# EAGLE design h_bridge_v2.1 (EAGLE 5.11)
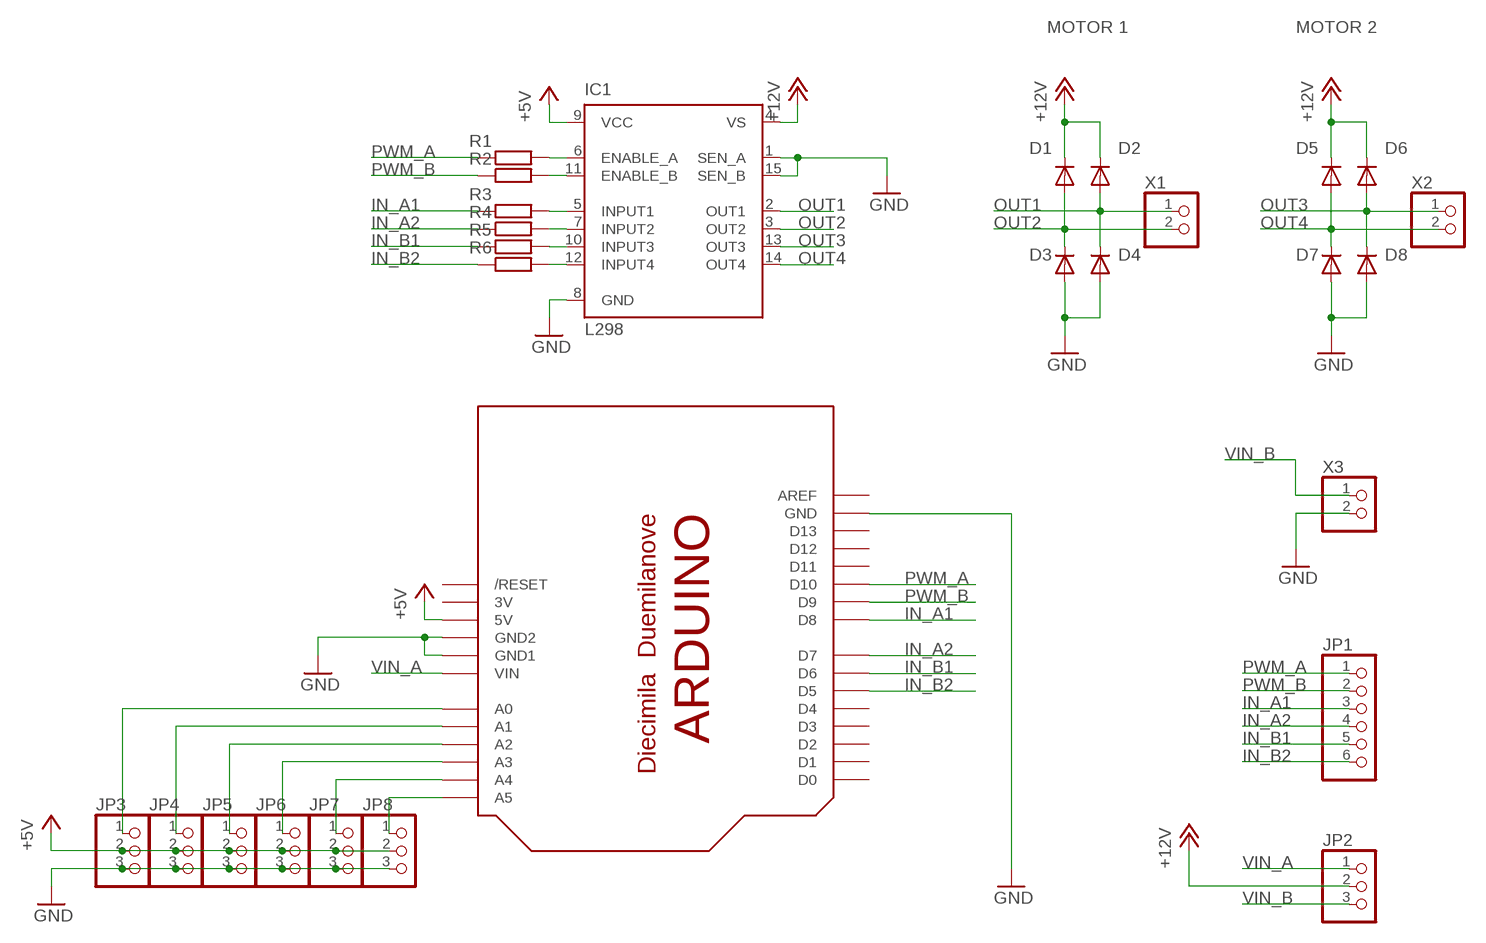
[diagram p0: schematic, sheet 1]

## Parts
D1  1N4004A  [DO41-10]
D2  1N4004A  [DO41-10]
D3  1N4004A  [DO41-10]
D4  1N4004A  [DO41-10]
D5  1N4004A  [DO41-10]
D6  1N4004A  [DO41-10]
D7  1N4004A  [DO41-10]
D8  1N4004A  [DO41-10]
IC1  L298  [MULTIWATT-15]
JP1  PINHD-1X6  [1X06]
JP2  PINHD-1X3180  [1X03]
JP3  PINHD-1X3180  [1X03]
JP4  PINHD-1X3180  [1X03]
JP5  PINHD-1X3180  [1X03]
JP6  PINHD-1X3180  [1X03]
JP7  PINHD-1X3180  [1X03]
JP8  PINHD-1X3180  [1X03]
R1  R-EU_0207/10  [0207/10]
R2  R-EU_0207/10  [0207/10]
R3  R-EU_0207/10  [0207/10]
R4  R-EU_0207/10  [0207/10]
R5  R-EU_0207/10  [0207/10]
R6  R-EU_0207/10  [0207/10]
U$1  ARDUINO-NOHOLE  [ARDUINO-NOHOLE]
X1  W237-102  [W237-102]
X2  W237-102  [W237-102]
X3  W237-102  [W237-102]

## Nets
+5V: IC1.9(VCC) JP3.2 JP4.2 JP5.2 JP6.2 JP7.2 JP8.2 U$1.5V
+12V: D1.C D2.C D5.C D6.C IC1.4(VS) JP2.2
GND: D3.A D4.A D7.A D8.A IC1.1(SEN_A) IC1.8(GND) IC1.15(SEN_B) JP3.3 JP4.3 JP5.3 JP6.3 JP7.3 JP8.3 U$1.GND U$1.GND1 U$1.GND2 X3.2
IN_A1: JP1.3 R3.1 U$1.D8
IN_A2: JP1.4 R4.1 U$1.D7
IN_B1: JP1.5 R5.1 U$1.D6
IN_B2: JP1.6 R6.1 U$1.D5
N$1: IC1.6(ENABLE_A) R1.2
N$2: IC1.11(ENABLE_B) R2.2
N$3: IC1.5(INPUT1) R3.2
N$4: IC1.7(INPUT2) R4.2
N$5: IC1.10(INPUT3) R5.2
N$6: IC1.12(INPUT4) R6.2
N$16: JP3.1 U$1.A0
N$17: JP4.1 U$1.A1
N$18: JP5.1 U$1.A2
N$19: JP6.1 U$1.A3
N$20: JP7.1 U$1.A4
N$21: JP8.1 U$1.A5
OUT1: D2.A D4.C IC1.2(OUT1) X1.1
OUT2: D1.A D3.C IC1.3(OUT2) X1.2
OUT3: D6.A D8.C IC1.13(OUT3) X2.1
OUT4: D5.A D7.C IC1.14(OUT4) X2.2
PWM_A: JP1.1 R1.1 U$1.D10
PWM_B: JP1.2 R2.1 U$1.D9
VIN_A: JP2.1 U$1.VIN
VIN_B: JP2.3 X3.1
Unconnected: U$1.AREF U$1.D0 U$1.D1 U$1.D2 U$1.D3 U$1.D4 U$1.D11 U$1.D12 U$1.D13 U$1.RESET(/RESET)

## Notes on the sheet
- MOTOR 1 | MOTOR 2

## Power pins joined to a net without a drawn wire
3V: U$1.3V

## Library data of the parts
D1-D8 = h_bridge_v2:1N4004: DIODE general purpose rectifier, 1 A
IC1 = h_bridge_v2:L298: DUAL FULL-BRIDGE DRIVER; MPN: L298N; OC_FARNELL: 1589425; OC_NEWARK: 32M1527
JP1 = h_bridge_v2:PINHD-1X6: PIN HEADER
JP2-JP8 = h_bridge_v2:PINHD-1X3: PIN HEADER
R1-R6 = h_bridge_v2:R-EU_: RESISTOR, European symbol
U$1 = h_bridge_v2:ARDUINO: Arduino Diecimila/Duemilanove Make a shield with ease, this package has all the named pins as well as the two mounting drill holes and an outline of the USB and DC power connector. The outline is on the DIMENSION layer, so if your board house uses it they will cut the outline to match. http://www.ladyada.net/library/pcb/eaglelibrary.html
X1-X3 = h_bridge_v2:W237-102: WAGO SCREW CLAMP

## Board
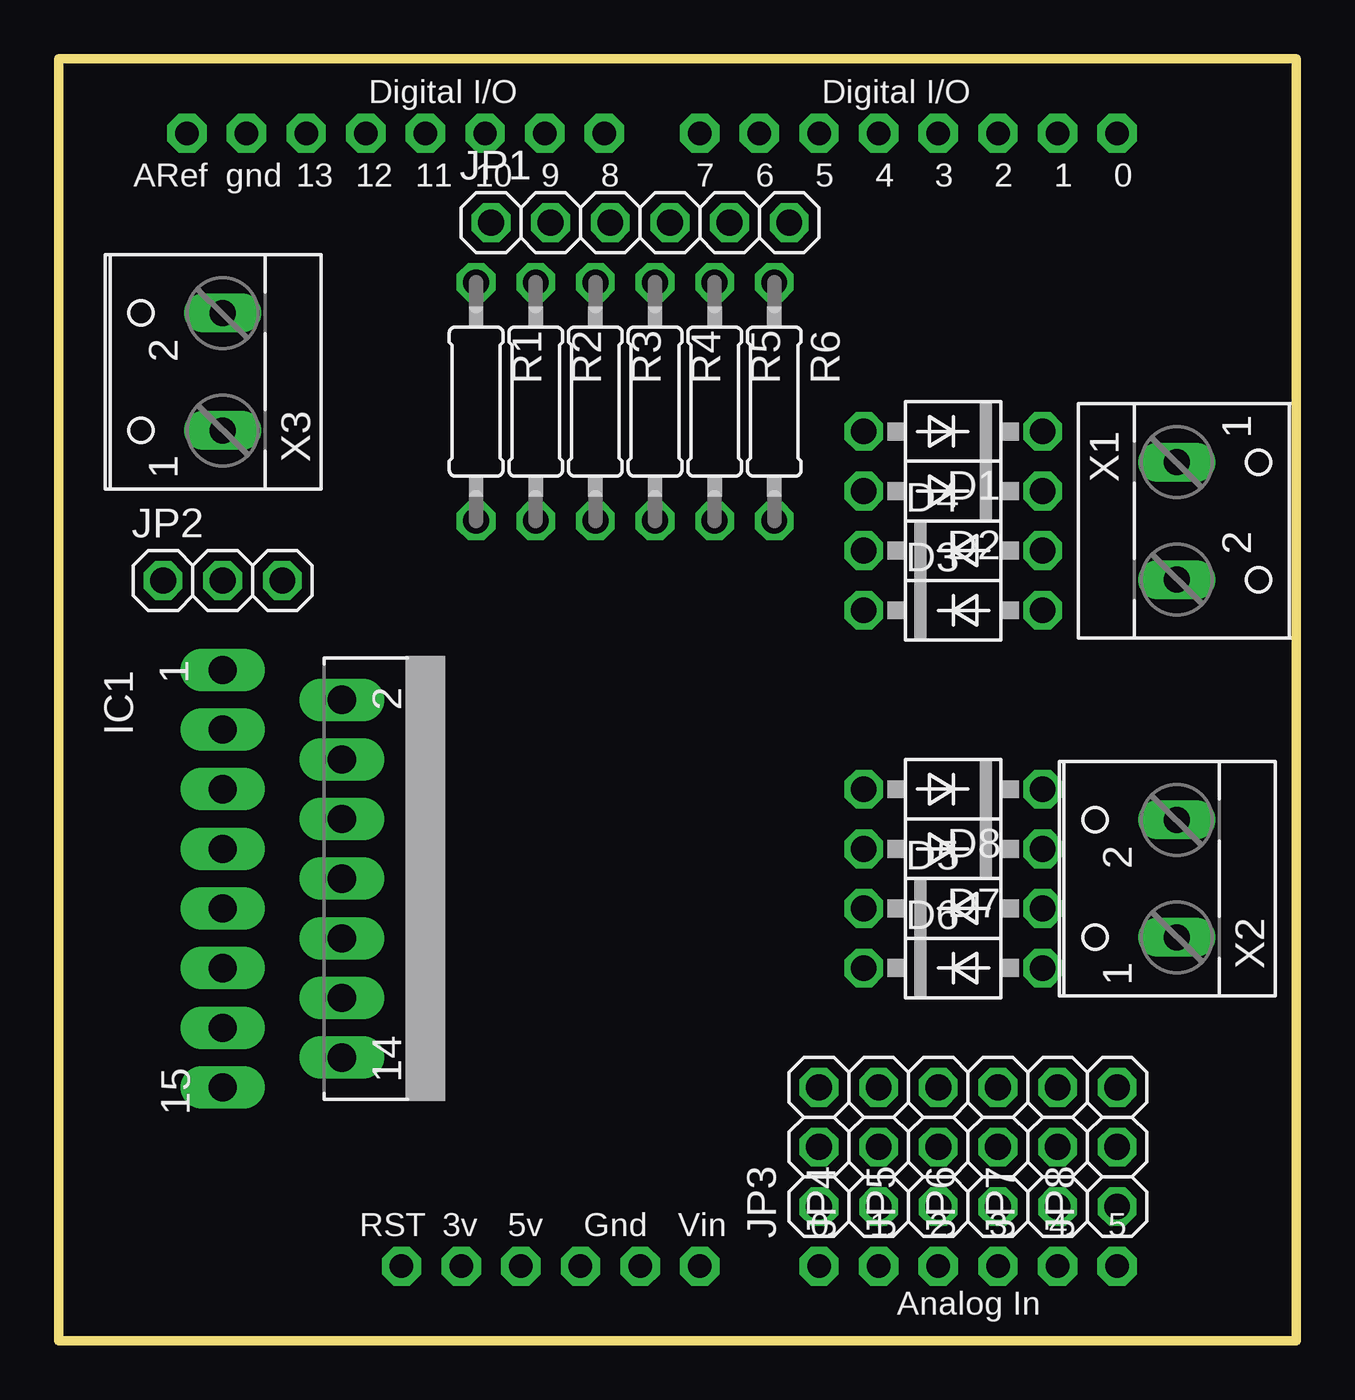
[diagram p1: board, top side]
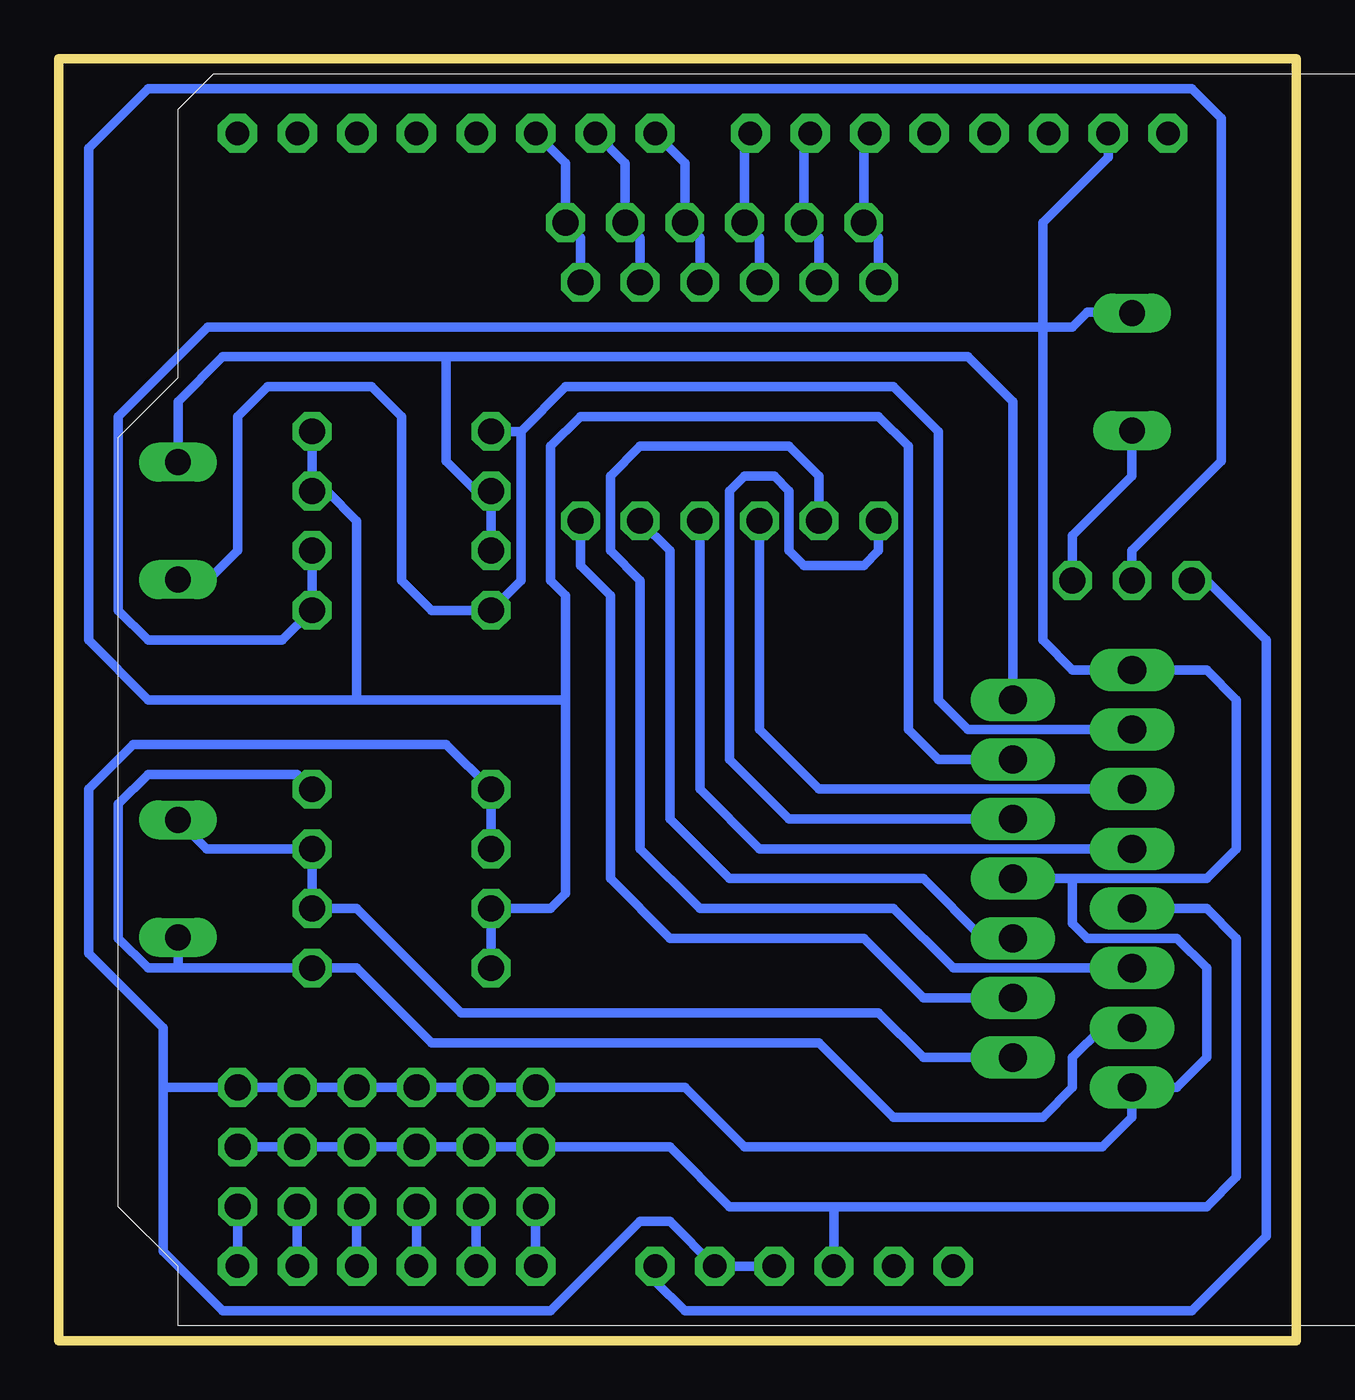
[diagram p2: board, bottom side, seen from below]

Size 52.7 x 54.61 mm. Coordinates in mm from the lower left corner, seen from the top.
Outline: 0,0 52.7,0 52.7,54.61 0,54.61 0,0
Copper layers (1*16): Top 0.035mm / dielectric 1.5mm / Bottom 0.035mm
Design rules "default": minimum track width 10mil, minimum drill 24mil, track to track 8mil, track to pad 8mil, pad to pad 8mil, via to via 8mil, smd to smd 8mil, copper to edge 40mil, drill to drill 8mil, minimum pad ring 10mil, minimum via ring 8mil, stop-mask expansion 4mil, vias tented up to drill 0mil, thermal gap 10mil

### Footprints (pad centres in the part's own frame; a part is rotated, then mirrored left to right if it is on the bottom)
DO41-10 = drill 1.1 octagon: A 3.81,0; C -3.81,0
MULTIWATT-15 = drill 1.2 long: 1 -8.89,-7.62; 2 -7.62,-2.54; 3 -6.35,-7.62; 4 -5.08,-2.54; 5 -3.81,-7.62; 6 -2.54,-2.54; 7 -1.27,-7.62; 8 0,-2.54; 9 1.27,-7.62; 10 2.54,-2.54; 11 3.81,-7.62; 12 5.08,-2.54; 13 6.35,-7.62; 14 7.62,-2.54; 15 8.89,-7.62
1X06 = drill 1.1 octagon: 1 -6.35,0; 2 -3.81,0; 3 -1.27,0; 4 1.27,0; 5 3.81,0; 6 6.35,0
1X03 = drill 1.1 octagon: 1 -2.54,0; 2 0,0; 3 2.54,0
0207/10 = drill 1.1 octagon: 1 -5.08,0; 2 5.08,0
ARDUINO-NOHOLE = drill 1 pad 1.676 octagon: 3V 35.56,2.54; 5V 38.1,2.54; A0 50.8,2.54; A1 53.34,2.54; A2 55.88,2.54; A3 58.42,2.54; A4 60.96,2.54; A5 63.5,2.54; AREF 23.876,50.8; D0 63.5,50.8; D1 60.96,50.8; D2 58.42,50.8; D3 55.88,50.8; D4 53.34,50.8; D5 50.8,50.8; D6 48.26,50.8; D7 45.72,50.8; D8 41.656,50.8; D9 39.116,50.8; D10 36.576,50.8; D11 34.036,50.8; D12 31.496,50.8; D13 28.956,50.8; GND 26.416,50.8; GND1 43.18,2.54; GND2 40.64,2.54; RESET 33.02,2.54; VIN 45.72,2.54
W237-102 = drill 1.1 long: 1 -2.5,-1.27; 2 2.5,-1.27

### Placement (x,y rotation side)
D1  38.1,38.73 180 top
D2  38.1,36.2 180 top
D3  38.1,31.11 0 top
D4  38.1,33.66 0 top
D5  38.1,18.41 0 top
D6  38.1,15.88 0 top
D7  38.1,20.95 180 top
D8  38.1,23.5 180 top
IC1  14.61,19.68 270 top
JP1  24.77,47.62 0 top
JP2  6.99,32.38 0 top
JP3  32.38,8.26 90 top
JP4  34.92,8.26 90 top
JP5  37.47,8.26 90 top
JP6  40.01,8.26 90 top
JP7  42.55,8.26 90 top
JP8  45.09,8.26 90 top
R1  17.78,40.01 270 top
R2  20.32,40.01 270 top
R3  22.86,40.01 270 top
R4  25.4,40.01 270 top
R5  27.94,40.01 270 top
R6  30.48,40.01 270 top
U$1  -18.41,0.64 0 top
X1  48.9,34.92 270 top
X2  46.35,19.68 90 top
X3  5.71,41.27 90 top

### Tracks (layer width: path | path; a pad name or v marks a point on that pad's centre or on a via)
+5V
  Bottom 0.406: 19.68,5.71 U$1.5V | 19.68,5.71 3.81,5.71 2.54,6.99 2.54,17.14 3.81,18.41 IC1.9 | JP8.2 JP7.2 JP6.2 JP5.2 JP4.2 JP3.2 26.67,8.26 24.13,5.71 19.68,5.71
+12V
  Bottom 0.406: D1.C D2.C 41.27,36.2 40.01,34.92 40.01,27.3 | 31.11,27.3 40.01,27.3 | 40.01,27.3 48.9,27.3 51.44,29.84 51.44,50.8 48.9,53.34 4.45,53.34 3.17,52.07 3.17,37.47 6.99,33.66 JP2.2 | IC1.4 15.24,24.77 16.51,26.04 16.51,38.1 17.78,39.37 30.48,39.37 31.75,38.1 31.75,32.38 31.11,31.75 31.11,27.3 | D6.C D5.C 31.75,18.41 31.11,19.05 31.11,27.3
GND
  Bottom 0.406: U$1.GND2 U$1.GND1 26.67,5.08 27.94,5.08 31.75,1.27 45.72,1.27 48.26,3.81 48.26,10.79 | 10.79,43.18 10.79,29.84 9.53,28.57 IC1.1 3.81,28.57 2.54,27.3 2.54,20.95 3.81,19.68 9.53,19.68 | U$1.GND 8,50.42 10.79,47.62 10.79,43.26 10.76,43.22 10.79,43.18 | 10.79,43.18 46.35,43.18 50.16,39.37 50.16,31.11 48.9,29.84 43.18,29.84 D3.A D4.A | 11.43,19.68 IC1.8 9.53,19.68 | 9.53,19.68 9.53,17.78 8.89,17.14 5.08,17.14 3.81,15.88 3.81,12.06 5.08,10.79 IC1.15 6.99,9.53 8.26,8.26 23.5,8.26 26.04,10.79 JP3.3 JP4.3 JP5.3 JP6.3 JP7.3 JP8.3 48.26,10.79 | D7.A D8.A 36.2,25.4 49.53,25.4 51.44,23.5 51.44,16.51 48.26,13.34 48.26,10.79 | 10.79,43.18 9.53,43.18 8.89,43.81 7.03,43.81 X3.2
IN_A1
  Bottom 0.406: U$1.D8 23.5,51.18 JP1.3 22.86,46.99 R3.1
IN_A2
  Bottom 0.406: U$1.D7 26.04,50.16 JP1.4 25.4,46.99 R4.1
IN_B1
  Bottom 0.406: U$1.D6 28.57,50.16 JP1.5 27.94,46.99 R5.1
IN_B2
  Bottom 0.406: U$1.D5 31.11,50.16 JP1.6 30.48,46.99 R6.1
N$1
  Bottom 0.406: IC1.6 21.59,22.23 24.13,24.77 24.13,36.2 23.5,36.83 22.23,36.83 21.59,36.2 21.59,33.66 20.95,33.02 18.41,33.02 17.78,33.66 R1.2
N$2
  Bottom 0.406: R2.2 20.32,36.83 21.59,38.1 27.94,38.1 29.21,36.83 29.21,33.66 27.94,32.38 27.94,20.95 25.4,18.41 17.14,18.41 14.61,15.88 IC1.11
N$3
  Bottom 0.406: IC1.5 20.32,23.5 22.86,26.04 R3.2
N$4
  Bottom 0.406: R4.2 25.4,23.5 22.86,20.95 IC1.7
N$5
  Bottom 0.406: IC1.10 13.34,17.14 15.88,19.68 24.13,19.68 26.67,22.23 26.67,33.66 R5.2
N$6
  Bottom 0.406: R6.2 30.48,33.02 29.21,31.75 29.21,19.68 26.67,17.14 18.41,17.14 15.88,14.61 IC1.12
N$16
  Bottom 0.406: U$1.A0 JP3.1
N$17
  Bottom 0.406: U$1.A1 JP4.1
N$18
  Bottom 0.406: U$1.A2 JP5.1
N$19
  Bottom 0.406: U$1.A3 JP6.1
N$20
  Bottom 0.406: U$1.A4 JP7.1
N$21
  Bottom 0.406: U$1.A5 JP8.1
OUT1
  Bottom 0.406: IC1.2 12.06,40.01 13.97,41.91 36.2,41.91 | 36.2,41.91 36.2,37.47 34.92,36.2 D2.A D4.C | 36.2,41.91 45.72,41.91 47.62,40.01 X1.1
OUT2
  Bottom 0.406: IC1.3 13.97,26.04 15.24,27.3 15.24,38.73 17.14,40.64 31.11,40.64 33.02,38.73 | 33.02,38.73 D1.A | 33.02,38.73 33.02,32.38 D3.C 36.83,31.11 38.1,32.38 38.1,39.37 39.37,40.64 43.81,40.64 45.08,39.37 45.08,33.66 46.35,32.38 47.59,32.38 X1.2
OUT3
  Bottom 0.406: IC1.13 8.26,13.34 9.53,12.06 9.53,10.79 10.79,9.53 17.14,9.53 20.32,12.7 36.83,12.7 40.01,15.88 D6.A 47.62,15.88 | 47.62,15.88 48.9,15.88 50.16,17.14 50.16,22.86 48.9,24.13 42.55,24.13 D8.C | 47.62,15.88 X2.1
OUT4
  Bottom 0.406: IC1.14 15.88,12.06 17.78,13.97 35.56,13.97 40.01,18.41 D5.A D7.C 46.4,20.95 X2.2
PWM_A
  Bottom 0.406: U$1.D10 18.41,51.18 JP1.1 17.78,46.99 R1.1
PWM_B
  Bottom 0.406: U$1.D9 20.95,51.18 JP1.2 20.32,46.99 R2.1
VIN_A
  Bottom 0.406: JP2.1 3.81,32.38 1.27,29.84 1.27,4.45 4.45,1.27 26.04,1.27 27.3,2.54 U$1.VIN
VIN_B
  Bottom 0.406: JP2.3 9.53,34.29 6.99,36.83 X3.1

### Text on the board
tDocu: - | +